# Altium project PCB_Project.PrjPcb
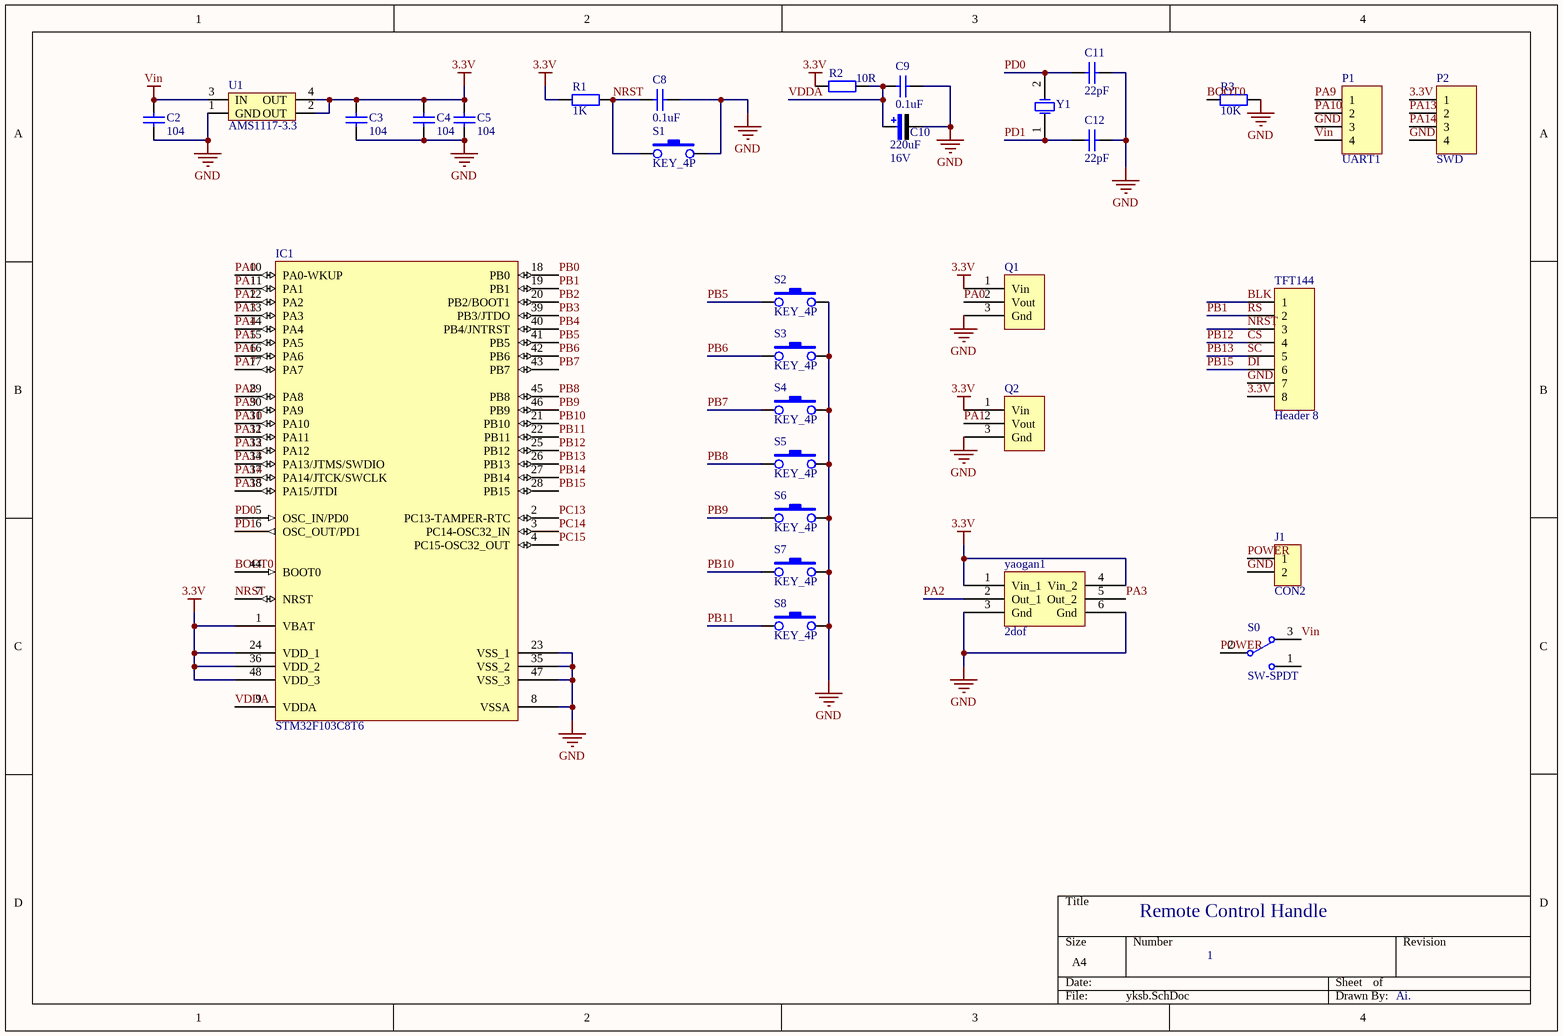
[diagram p0: yksb.SchDoc]
1 sheet, 31 parts. Net scope: global (net labels, ports and power ports of the same name join across sheets).
Board file: yksb.PcbDoc

## Sheet yksb.SchDoc
size A4

### Parts
C2  value 104  [C-RAD-0603]  (hidden comment: Cap)
C3  value 104  [C-RAD-0603]  (hidden comment: Cap)
C4  value 104  [C-RAD-0603]  (hidden comment: Cap)
C5  value 104  [C-RAD-0603]  (hidden comment: Cap)
C8  value 0.1uF  [C-RAD-0603]  (hidden comment: Cap)
C9  value 0.1uF  [C-RAD-0603]  (hidden comment: Cap)
C10  value 220uF  Vol: 16V  [C-RB-S6]  (hidden comment: Cap Pol)
C11  value 22pF  [C-RAD-0603]  (hidden comment: Cap)
C12  value 22pF  [C-RAD-0603]  (hidden comment: Cap)
IC1  STM32F103C8T6  [LQFP48_M]
J1  CON2  [DC-005]
P1  UART1  [HDR1X4]
P2  SWD  [HDR1X4]
Q1  (no value)  [dianweiqi]
Q2  (no value)  [dianweiqi]
R1  value 1K  [0603-1]  (hidden comment: Res1)
R2  value 10R  [0603-1]  (hidden comment: Res1)
R3  value 10K  [0603-1]  (hidden comment: Res1)
S0  SW-SPDT  [SWITCH_A2]
S1  KEY_4P  [KEY_M]
S2  KEY_4P  [KEY_M]
S3  KEY_4P  [KEY_M]
S4  KEY_4P  [KEY_M]
S5  KEY_4P  [KEY_M]
S6  KEY_4P  [KEY_M]
S7  KEY_4P  [KEY_M]
S8  KEY_4P  [KEY_M]
TFT144  Header 8  [HDR1X8]
U1  AMS1117-3.3  [AMS1117]
Y1  XTAL  [XTAL_US]  (value not drawn)
yaogan1  2dof  [yaogan1]

### Nets
3.3V: C3.1 C4.1 C5.1 IC1.1(VBAT) IC1.24(VDD_1) IC1.36(VDD_2) IC1.48(VDD_3) P2.1 Q1.1(Vin) Q2.1(Vin) R1.1 R2.1 TFT144.8 U1.2(OUT) U1.4(OUT) yaogan1.1(Vin_1) yaogan1.4(Vin_2)
GND: C2.2 C3.2 C4.2 C5.2 C8.1 C9.1 C10.2 C11.2 C12.2 IC1.8(VSSA) IC1.23(VSS_1) IC1.35(VSS_2) IC1.47(VSS_3) J1.2 P1.3 P2.4 Q1.3(Gnd) Q2.3(Gnd) R3.2 S1.2 S2.2 S3.2 S4.2 S5.2 S6.2 S7.2 S8.2 TFT144.7 U1.1(GND) yaogan1.3(Gnd) yaogan1.6(Gnd)
Vin: C2.1 P1.4 S0.3 U1.3(IN)
BLK: TFT144.1
BOOT0: IC1.44(BOOT0) R3.1
CS: IC1.25(PB12) TFT144.4  [also labelled PB12]
DI: IC1.28(PB15) TFT144.6  [also labelled PB15]
NRST: C8.2 IC1.7(NRST) R1.2 S1.1 TFT144.3
PA0: IC1.10(PA0-WKUP) Q1.2(Vout)
PA1: IC1.11(PA1) Q2.2(Vout)
PA2: IC1.12(PA2) yaogan1.2(Out_1)
PA3: IC1.13(PA3) yaogan1.5(Out_2)
PA4: IC1.14(PA4)
PA5: IC1.15(PA5)
PA6: IC1.16(PA6)
PA7: IC1.17(PA7)
PA8: IC1.29(PA8)
PA9: IC1.30(PA9) P1.1
PA10: IC1.31(PA10) P1.2
PA11: IC1.32(PA11)
PA12: IC1.33(PA12)
PA13: IC1.34(PA13/JTMS/SWDIO) P2.2
PA14: IC1.37(PA14/JTCK/SWCLK) P2.3
PA15: IC1.38(PA15/JTDI)
PB0: IC1.18(PB0)
PB1: IC1.19(PB1) TFT144.2  [also labelled RS]
PB2: IC1.20(PB2/BOOT1)
PB3: IC1.39(PB3/JTDO)
PB4: IC1.40(PB4/JNTRST)
PB5: IC1.41(PB5) S2.1
PB6: IC1.42(PB6) S3.1
PB7: IC1.43(PB7) S4.1
PB8: IC1.45(PB8) S5.1
PB9: IC1.46(PB9) S6.1
PB10: IC1.21(PB10) S7.1
PB11: IC1.22(PB11) S8.1
PB13: IC1.26(PB13) TFT144.5  [also labelled SC]
PB14: IC1.27(PB14)
PC13: IC1.2(PC13-TAMPER-RTC)
PC14: IC1.3(PC14-OSC32_IN)
PC15: IC1.4(PC15-OSC32_OUT)
PD0: C11.1 IC1.5(OSC_IN/PD0) Y1.2(OSC2)
PD1: C12.1 IC1.6(OSC_OUT/PD1) Y1.1(OSC1)
POWER: J1.1 S0.2
VDDA: C9.2 C10.1 IC1.9(VDDA) R2.2

Not connected (* = marked no-connect by the designer): S0 1

### Notes on the sheet
- Remote Control Handle
- 1
- Ai.

### Library data of the parts
C2-C5 C8 C9 C11 C12 = Cap: 无极性电容; Published: 8-Jun-2000; LatestRevisionDate: 17-Jul-2002; LatestRevisionNote: Re-released for DXP Platform.; PackageReference: RAD-0.3; Publisher: Altium Limited
C10 = Cap Pol: 极性电解电容; Published: 8-Jun-2000; LatestRevisionDate: 17-Jul-2002; LatestRevisionNote: Re-released for DXP Platform.; PackageReference: RB7.6-15; Publisher: Altium Limited
IC1 = STM32F103C8T6: 单片机; Published: 30-May-2008; DatasheetVersion: rev6, Mar-2008; PackageVersion: Mar-2008; PackageReference: LQFP48; Publisher: Altium Limited; PackageDescription: 48-Pin Low-Profile Quad Flat Pack, 7 x 7 mm Body, 0.5 mm Pitch (LQFP48); ComponentLink1Description: Manufacturer Link; ComponentLink1URL: www.st.com/stm32; ComponentLink2Description: Datasheet; ComponentLink2URL: http://www.st.com/stonline/products/literature/ds/13587.pdf
J1 = CON2: 连接器
P1 P2 = Header 4: Header, 4-Pin; LatestRevisionDate: 17-Jul-2002; LatestRevisionNote: Re-released for DXP Platform.; Publisher: Altium Limited
Q1 Q2 = dianweiqi
R1-R3 = Res1: 贴片电阻; Published: 8-Jun-2000; LatestRevisionDate: 17-Jul-2002; LatestRevisionNote: Re-released for DXP Platform.; PackageReference: AXIAL-0.4; Publisher: Altium Limited
S0 = SW-SPDT: 开关; Published: 24-Mar-1999; LatestRevisionDate: 17-Dec-2003; LatestRevisionNote: Schematic revised, PCB Footprint replaced.; DatasheetDocument: 05-Dec-2000; PackageReference: TL36WW15050; Publisher: Altium Limited; ComponentLink1Description: Manufacturer Link; ComponentLink1URL: http://www.apem.com
S1-S8 = KEY_4P: 轻触按键4P
TFT144 = Header 8: Header, 8-Pin; LatestRevisionDate: 17-Jul-2002; LatestRevisionNote: Re-released for DXP Platform.; Publisher: Altium Limited
U1 = AMS1117
Y1 = XTAL: Crystal Oscillator; Published: *; LatestRevisionDate: *; LatestRevisionNote: *; Publisher: *
yaogan1 = yaogan1